# Altium project Super Burst.PrjPcb
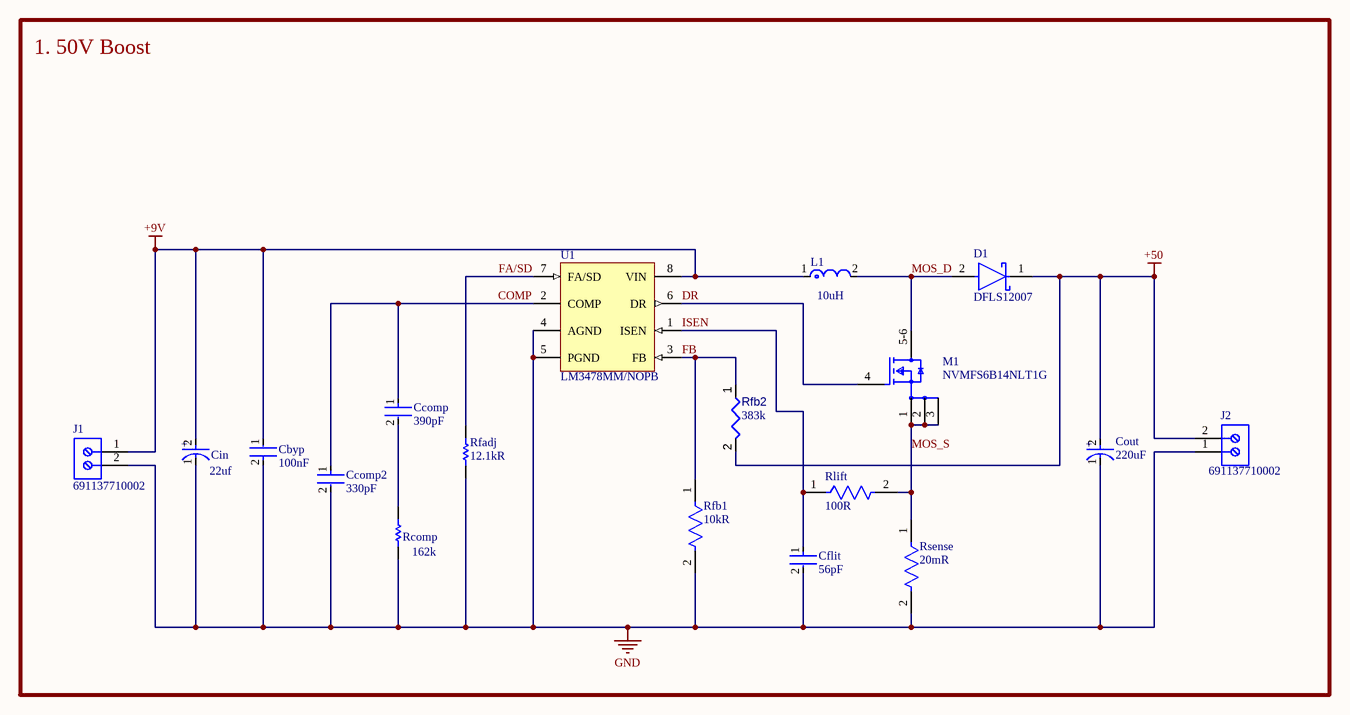
[diagram p0: 50VBoost.SchDoc]
1 sheet, 18 parts. Net scope: global (net labels, ports and power ports of the same name join across sheets).
Board file: 50VBoost.PcbDoc

## Sheet 50VBoost.SchDoc
size B; SheetNumber: 1; SheetTotal: 1

### Parts
Cbyp  value 100nF  [FP-GRM15-MFG]  (hidden comment: GRM155R71C104KA88D)
Ccomp  value 390pF  [FP-GRM033-0_03-MFG]  (hidden comment: GRM033R71C391KA01D)
Ccomp2  value 330pF  [FP-CGA1A-0_1-0_03-MFG]  (hidden comment: CGA1A2X7R1H331K030BA)
Cflit  value 56pF  [FP-CL02-IPC_A]  (hidden comment: CL02C560JQ2ANNC)
Cin  22uf  [FP-POSCAP-B2-MFG]
Cout  value 220uF  [FP-FKK16-MFG]  (hidden comment: EEV-FK2A221M)
D1  DFLS12007  [FP-PowerDI123-MFG]
J1  691137710002  [691137710002]
J2  691137710002  [691137710002]
L1  value 10uH  [FP-XAL6060-MFG]  (hidden comment: XAL6060-103MEB)
M1  NVMFS6B14NLT1G  [FP-488AA-MFG]
Rcomp  162k  [RESC0603X26X15NL03T05]
Rfadj  value 12.1kR  [RESC0603X26X15NL03T05]  (hidden comment: ERJ-1GEF1212C)
Rfb1  value 10kR  [FP-ERJ1G-MFG]  (hidden comment: ERJ-1GNF1002C)
Rfb2  value 383k  [RESC0402(1005)_L]  (hidden comment: Resistor 383K +/-1 % 0402 63 mW)
Rlift  value 100R  [FP-CRCW0402-e3-IPC_A]  (hidden comment: CRCW0402100RFKED)
Rsense  value 20mR  [FP-CSR1206-IPC_A]  (hidden comment: CSR1206FK20L0)
U1  LM3478MM/NOPB  [DGK0008A_M]

### Blocks framed on the sheet
1. 50V Boost: Cbyp Ccomp Ccomp2 Cflit Cin Cout D1 J1 J2 L1 M1 Rcomp Rfadj Rfb1 Rfb2 Rlift Rsense U1

### Nets
+9V: Cbyp.1 Cin.2(A) J1.1 L1.1 U1.8(VIN)
+50: Cout.2(A) D1.1(C) J2.2 Rfb2.2
GND: Cbyp.2 Ccomp2.2 Cflit.2 Cin.1(C) Cout.1(C) J1.2 J2.1 Rcomp.2 Rfadj.2 Rfb1.2 Rsense.2 U1.4(AGND) U1.5(PGND)
COMP: Ccomp.1 Ccomp2.1 U1.2(COMP)
DR: M1.4(G) U1.6(DR)
FA/SD: Rfadj.1 U1.7(FA/SD)
FB: Rfb1.1 Rfb2.1 U1.3(FB)
ISEN: Cflit.1 Rlift.1 U1.1(ISEN)
MOS_D: D1.2(A) L1.2 M1.5-6(D)
MOS_S: M1.1(S) M1.2(S) M1.3(S) Rlift.2 Rsense.1
NetCcomp_2: Ccomp.2 Rcomp.1

### Notes on the sheet
- (in symbol CMP-001-00091-1) +
- (in symbol CMP-001-00095-1) +

### Library data of the parts
Cbyp = CMP-001-00088-1: Multilayer Ceramic Capacitor, 0.1 uF, 16 V, ± 10%, X7R, 0402 [1005 Metric]; Voltage: 16V; Packaging: Tape and Reel; Depth: 0.5mm; RoHS Compliant: Yes; Length: 1mm; Width: 0.02inch; Reach SVHC Compliant: Unknown; Lead Free: Lead Free; Case Code (Metric): 1005; Dielectric: X7R; Min Operating Temperature: -55°C; Pins: 2; Mounting Technology: Surface Mount; Dielectric Material: Ceramic; Radiation Hardening: No; Material: Ceramic; Voltage Rating (DC): 16V; Max Operating Temperature: 125°C; Tolerance: 10%; Voltage Rating: 16V; Height: 0.5mm; Package Quantity: 1; Case/Package: 0402; Termination: SMD/SMT; Case Code (Imperial): 0402; Series: GRM; Thickness: 0.022inch
Ccomp = CMP-001-00093-1: Cap Ceramic 390pF 16V X7R 10% SMD 0201 125°C Paper T/R; Voltage Rating: 16V; Max Operating Temperature: 125°C; Series: GRM; Case/Package: 0201; Termination: SMD/SMT; Height: 0.3mm; Package Quantity: 15000; RoHS Compliant: Yes; Dielectric: X7R; Case Code (Metric): 0603; Voltage Rating (DC): 16V; Mounting Technology: Surface Mount; Tolerance: 10%; Case Code (Imperial): 0201; Thickness: 0.013inch; Depth: 0.3mm; Radiation Hardening: No; Min Operating Temperature: -55°C; Packaging: Tape and Reel; Construction: Flat; Length: 0.6mm; Width: 0.012inch
Ccomp2 = CMP-001-00094-1: Cap Ceramic 330pF 50V X7R 10% Pad SMD 0201 125C Automotive T/R; Series: CGA; Height: 0.3mm; Case Code (Imperial): 0201; Dielectric: X7R; Length: 0.024inch; Max Operating Temperature: 125°C; RoHS Compliant: Yes; Case Code (Metric): 0603; Width: 0.012inch; Voltage Rating (DC): 50V; Package Quantity: 1; Thickness: 0.012inch; Packaging: Tape and Reel; Tolerance: 10%; Mounting Technology: Surface Mount; Weight: 6E-06oz; Termination: SMD/SMT; Min Operating Temperature: -55°C; Ratings: AEC-Q200; Voltage Rating: 50V; Case/Package: 0201
Cflit = CMP-001-00092-1: Cap Ceramic 56pF 6.3V C0G 5% SMD 01005 125°C Cardboard T/R; Thickness: 0.009inch; Mounting Technology: Surface Mount; Case Code (Imperial): 1005; Max Operating Temperature: 125°C; Height: 0.2mm; Construction: Flat; Tolerance: 5%; Case/Package: Ceramic; Radiation Hardening: No; Voltage Rating: 6.3V; Packaging: Tape and Reel; Depth: 0.2mm; Length: 0.4mm; Package Quantity: 1; RoHS Compliant: Yes; Case Code (Metric): 0402; Min Operating Temperature: -55°C; Width: 0.008inch; Dielectric: C0G; Series: CL
Cin = CMP-001-00091-1: Cap Tant Solid 22uF 20V B2 CASE 20% (3.5 X 2.8 X 1.9mm) SMD 3528 0.09 Ohm 105 C Embossed T/R
Cout = CMP-001-00095-1: Aluminum Electrolytic Capacitor, Polarized, Aluminum (wet), 35V, 20% +Tol, 20% -Tol, 100uF; Dissipation Factor: 7%; Life (Hours): 5000Hour; Voltage: 100V; Leakage Current: 3uA; Ripple Current: 917mA; ESR (Equivalent Series Resistance): 153mR; Dielectric Material: Aluminium; Ratings: AEC-Q200; Radiation Hardening: No; Diameter: 18mm; Voltage Rating (AC): 100V; Max Operating Temperature: 105°C; Voltage Rating: 100V; Width: 1.2mm; Pins: 2; Series: FK; Ripple Current (AC): 917mA; Height: 16.5mm; Termination: SMD/SMT; Length: 17mm; Voltage Rating (DC): 100V; Reach SVHC Compliant: No; Packaging: Tape and Reel; Package Quantity: 125; Case/Package: Radial; Lead Free: Lead Free; Min Operating Temperature: -55°C; Construction: Cylindrical; Mounting Technology: Surface Mount,PCB; RoHS Compliant: Yes; Tolerance: 20%; Impedance: 153mR
D1 = CMP-004-00032-1: Rectifier Diode, Schottky, 1 Phase, 1 Element, 1A, 200V V(RRM), Silicon; Polarity: Standard; Max Forward Surge Current (Ifsm): 40A; Element Configuration: Single; Value: 23pF; Forward Voltage: 850mV; Max Reverse Current: 2uA; Contact Plating: Tin,Matte; Radiation Hardening: No; Pins: 123; Mounting Technology: Surface Mount; Max Operating Temperature: 150°C; Length: 2.8mm; Output Current: 1A; Max Reverse Voltage (DC): 200V; Weight: 1.058219oz; Peak Non-Repetitive Surge Current: 40A; Current Rating: 1A; Packaging: Cut Tape; Voltage Rating (DC): 200V; Max Repetitive Reverse Voltage (Vrrm): 200V; Series: DFLS1200; Min Operating Temperature: -65°C; Width: 1.78mm; Forward Current: 1A; Average Rectified Current: 1A; Height: 0.98mm; Package Quantity: 3000; Termination: SMD/SMT; Lead Free: Lead Free; Reach SVHC Compliant: Yes
J1 J2 = CMP-002-00088-1: Series 1377 - 5.00 mm Horizontal Entry with Pressure Clamp WR-TBL, 2 pin; Number of Contacts: 2; Current: 16A; Wire Gauge (Max): 30AWG; Voltage: 300V; Plating: Copper Alloy,ZINC PLATED; Wire Gauge (Min): 12AWG; Number of Levels: 1; Housing Material: PC; RoHS Compliant: Yes; Termination: Screw; Contact Material: Nickel,Tin; Color: Green; Pins: 2; Number of Rows: 1; Max Operating Temperature: 120°C; Current Rating: 16A; Number of Positions Per Level: 2; Mounting Technology: Through Hole; Min Operating Temperature: -30°C; Height: 11.6mm; Series: WR-TBL Series 1377; Lead Pitch: 5mm; Voltage Rating: 300V
L1 = CMP-006-00022-1: Power inductor, shielded, 20% tol, SMT, RoHS, halogen f; Self Resonant Frequency: 14MHz; Max DC Current: 7A; Test Frequency: 100kHz; Core Material: Composite; Lead Free: Contains Lead; Tolerance: 20%; RoHS Compliant: Yes; Packaging: Tape and Reel; Length: 6.76mm; Shielding: Shielded; Min Operating Temperature: -40°C; Termination: SMD/SMT; Height: 6.1mm; Series: XAL6060; Width: 6.56mm; Max Operating Temperature: 125°C; Package Quantity: 21
M1 = CMP-013-00037-1: Single N-Channel Power MOSFET 100V, 55A, 13mΩ; Rds On Max: 13mR; Max Power Dissipation: 94W; Input Capacitance: 1.68nF; Threshold Voltage: 3V; Reach SVHC Compliant: No; Drain to Source Voltage (Vdss): 100V; Series: Automotive, AEC-Q101; Mounting Technology: Surface Mount; Min Operating Temperature: -55°C; Pins: 8; Max Operating Temperature: 175°C; Continuous Drain Current (ID): 55A; Packaging: Cut Tape; Lead Free: Lead Free; RoHS Compliant: Yes; Case/Package: DFN
Rcomp = CMP-009-00195-1: Res, Thick Film, 162K, 1%, 0.05W, 0201
Rfadj = CMP-009-00192-1: Res Thick Film 0201 12.1K Ohm 1% 1/20W ±200ppm/°C Molded SMD Pressed Carrier T/R; Voltage Rating: 25V; Power Rating: 50mW; Voltage Rating (DC): 15V; Case Code (Metric): 0603; Case Code (Imperial): 0201; Contact Plating: Tin; Temperature Coefficient: 200ppm/°C; Width: 0.3mm; Number of Terminations: 2; Case/Package: 0201; Termination: SMD/SMT; Radiation Hardening: No; Series: ERJ; Mounting Technology: Surface Mount; Max Power Dissipation: 50mW; Lead Free: Lead Free; Height: 0.01inch; Weight: 6E-06oz; Max Operating Temperature: 125°C; RoHS Compliant: Yes; Tolerance: 1%; Packaging: Tape and Reel; Length: 0.024inch; Min Operating Temperature: -55°C; Package Quantity: 15000
Rfb1 = CMP-009-00191-1: SMD Chip Resistor, 10 kOhm, ± 1%, 50 mW, 0201 [0603 Metric], Thick Film, General Purpose; Temperature Coefficient: 200ppm/°C; Power Rating: 50mW; Voltage Rating: 25V; Length: 0.024inch; Package Quantity: 15000; Series: ERJ; Packaging: Tape and Reel; Ratings: AEC-Q200; Height: 0.01inch; Max Operating Temperature: 125°C; RoHS Compliant: Yes; Radiation Hardening: No; Contact Plating: Tin,Matte; Tolerance: 1%; Resistor Type: Thick Film; Features: Automotive AEC-Q200; Case/Package: 0201; Width: 0.3mm; Reach SVHC Compliant: Unknown; Case Code (Imperial): 0201; Case Code (Metric): 0603; Resistance Tolerance: 1%; Min Operating Temperature: -55°C; Pins: 2; Max Power Dissipation: 50mW; Number of Terminations: 2; Lead Free: Lead Free; Mounting Technology: Surface Mount; Voltage Rating (DC): 25V
Rfb2 = CMP-009-00126-3: Chip Resistor, 383 kOhms, +/-1 %, 63 mW, -55 to 155 degC, 0402; Tolerance: 1%; Power: 63mW; Max Operating Temperature: 155°C; Pins: 2; Min Operating Temperature: -55°C; Case/Package: 0402
Rlift = CMP-009-00193-1: SMD Chip Resistor, 100 Ohm, ± 1%, 63 mW, 0402 [1005 Metric], Thick Film, General Purpose; Working Voltage: 50V; Power Rating: 63mW; Temperature Coefficient: 100ppm/°C; Resistor Type: Thick Film; Technology: THICK FILM; Length: 1mm; Max Operating Temperature: 155°C; Contact Plating: Tin; Weight: 2.3E-05oz; Height: 0.35mm; Case Code (Metric): 1005; Packaging: Tape and Reel; Package Quantity: 10; Features: Automotive AEC-Q200; Radiation Hardening: No; Number of Terminations: 2; Min Operating Temperature: -55°C; Resistance Tolerance: 1%; Width: 0.02inch; Ratings: AEC-Q200; Depth: 0.5mm; Series: CRCW; Military Standard: Not; Voltage Rating (DC): 50V; Termination: SMD/SMT; Lead Free: Lead Free; Case/Package: 0402; RoHS Compliant: Yes; Construction: Rectangular; Case Code (Imperial): 0402; Voltage Rating: 50V; Tolerance: 1%; Reach SVHC Compliant: Unknown; Max Power Dissipation: 63mW
Rsense = CMP-009-00194-1: Res Thick Film 1206 0.02 Ohm 1% 1/2W ±100ppm/°C Molded SMD SMD Paper T/R; Power Rating: 500mW; Packaging: Tape and Reel; Series: CSR; Min Operating Temperature: -55°C; Length: 0.12inch; Lead Free: Lead Free; Width: 0.061inch; Mounting Technology: Surface Mount; Case/Package: 1206; Contact Plating: Tin,Matte; Max Power Dissipation: 500mW; Max Operating Temperature: 155°C; Temperature Coefficient: 100ppm/°C; Tolerance: 1%; Depth: 1.55mm; Number of Terminations: 2; RoHS Compliant: Yes; Military Standard: Not; Case Code (Imperial): 1206; Construction: Rectangular; Radiation Hardening: No; Case Code (Metric): 3216; Height: 0.026inch
U1 = CMP-019-00052-1: IC REG CTRLR MULT TOP 8VSSOP; Max Output Voltage: 5V; Min Input Voltage: 2.97V; Max Output current: 2A; Output Configuration: Positive; Output Type: Adjustable; Max Duty Cycle: 100%; Quiescent Current: 2.7mA; Frequency: 400kHz; Output Voltage: 1.26V; Clock Sync: No; Output Current: 1A; Topology: Boost,Flyback,SEPIC; Switching Frequency: 1MHz; Max Supply Voltage: 40V; Number of Outputs: 1; Termination: SMD/SMT; Series: -; Height: 0.86mm; Length: 3mm; Reach SVHC Compliant: No; Radiation Hardening: No; Min Operating Temperature: -40°C; Max Operating Temperature: 125°C; RoHS Compliant: Yes; Pins: 8; Case/Package: MSOP; Packaging: Tape and Reel; Min Supply Voltage: 2.97V; Mounting Technology: Surface Mount; Lead Free: Lead Free; Synchronous Rectifier: No; Width: 3mm; Number of Output Phases: 1; Package Quantity: 1000